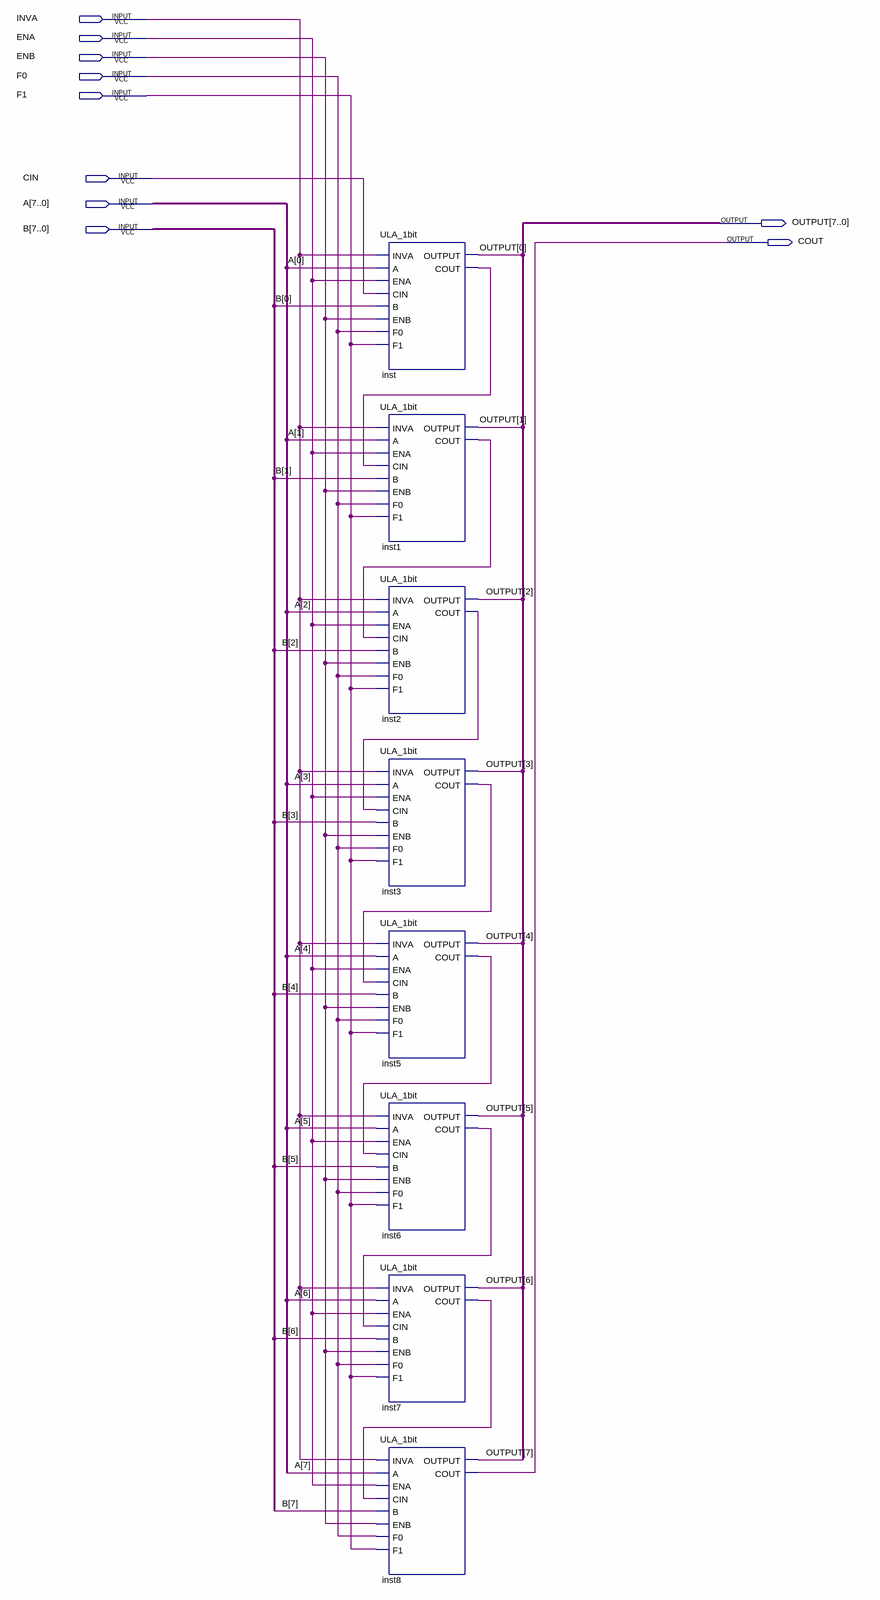
[diagram p0: schematic sheet]
// Quartus schematic ULA_8bit.bdf as structural Verilog: 8 symbols, 10 pins
module ULA_8bit (
  input  INVA,
  input  ENA,
  input  ENB,
  input  F0,
  input  F1,
  input  CIN,
  input  [7:0] A,
  input  [7:0] B,
  output [7:0] OUTPUT,
  output COUT
);

  wire inst1_cout, inst2_cout, inst3_cout, inst5_cout, inst6_cout, inst7_cout, inst_cout;

  ULA_1bit inst (
    .INVA(INVA), .A(A[0]), .ENA(ENA), .CIN(CIN), .B(B[0]), .ENB(ENB), .F0(F0), .F1(F1), .OUTPUT(OUTPUT[0]),
    .COUT(inst_cout));
  ULA_1bit inst1 (
    .INVA(INVA), .A(A[1]), .ENA(ENA), .CIN(inst_cout), .B(B[1]), .ENB(ENB), .F0(F0), .F1(F1),
    .OUTPUT(OUTPUT[1]), .COUT(inst1_cout));
  ULA_1bit inst2 (
    .INVA(INVA), .A(A[2]), .ENA(ENA), .CIN(inst1_cout), .B(B[2]), .ENB(ENB), .F0(F0), .F1(F1),
    .OUTPUT(OUTPUT[2]), .COUT(inst2_cout));
  ULA_1bit inst3 (
    .INVA(INVA), .A(A[3]), .ENA(ENA), .CIN(inst2_cout), .B(B[3]), .ENB(ENB), .F0(F0), .F1(F1),
    .OUTPUT(OUTPUT[3]), .COUT(inst3_cout));
  ULA_1bit inst5 (
    .INVA(INVA), .A(A[4]), .ENA(ENA), .CIN(inst3_cout), .B(B[4]), .ENB(ENB), .F0(F0), .F1(F1),
    .OUTPUT(OUTPUT[4]), .COUT(inst5_cout));
  ULA_1bit inst6 (
    .INVA(INVA), .A(A[5]), .ENA(ENA), .CIN(inst5_cout), .B(B[5]), .ENB(ENB), .F0(F0), .F1(F1),
    .OUTPUT(OUTPUT[5]), .COUT(inst6_cout));
  ULA_1bit inst7 (
    .INVA(INVA), .A(A[6]), .ENA(ENA), .CIN(inst6_cout), .B(B[6]), .ENB(ENB), .F0(F0), .F1(F1),
    .OUTPUT(OUTPUT[6]), .COUT(inst7_cout));
  ULA_1bit inst8 (
    .INVA(INVA), .A(A[7]), .ENA(ENA), .CIN(inst7_cout), .B(B[7]), .ENB(ENB), .F0(F0), .F1(F1),
    .OUTPUT(OUTPUT[7]), .COUT(COUT));
endmodule
